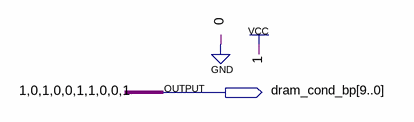
[diagram p0: schematic sheet]
// Quartus schematic dram_cond_bp.bdf as structural Verilog: 0 symbols, 1 pins
module dram_cond_bp (
  output [9:0] dram_cond_bp
);


  assign dram_cond_bp = 10'b1010011001;
endmodule
